# Altium project Hierarchical Project.PrjPcb
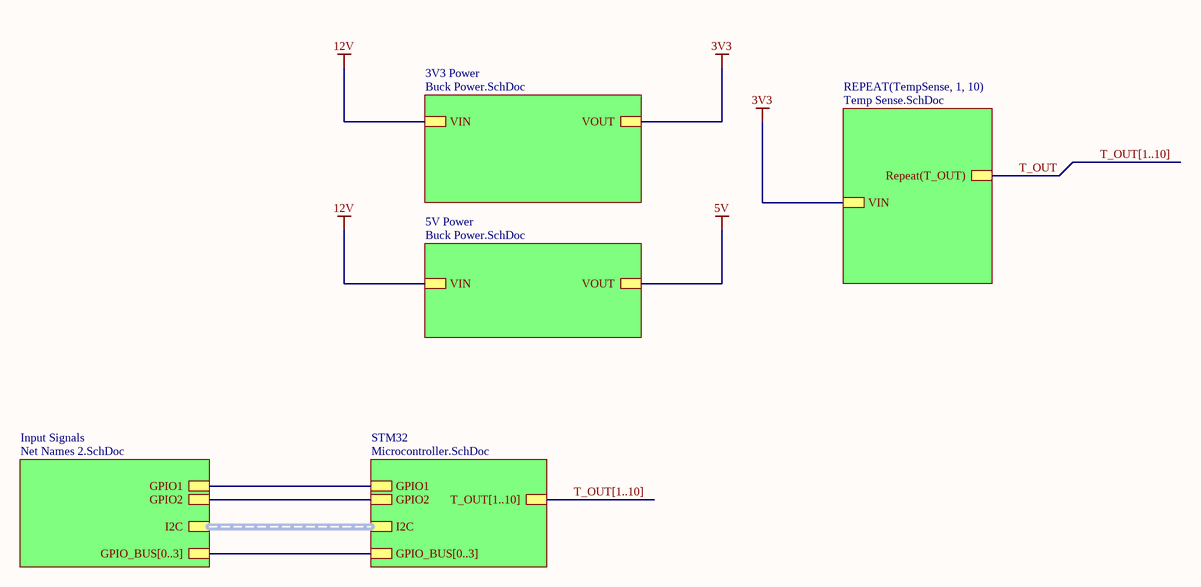
[diagram p0: Top.SchDoc]
5 sheets, 29 parts. Net scope: hierarchical (ports join the sheet entries above them; power ports are global).
Board file: Hierarchical Project.PcbDoc
Sheets:
  Top.SchDoc
    3V3 Power = Buck Power.SchDoc
    Input Signals = Net Names 2.SchDoc
    STM32 = Microcontroller.SchDoc
    5V Power = Buck Power.SchDoc
    TempSense1 = Temp Sense.SchDoc
    TempSense2 = Temp Sense.SchDoc
    TempSense3 = Temp Sense.SchDoc
    TempSense4 = Temp Sense.SchDoc
    TempSense5 = Temp Sense.SchDoc
    TempSense6 = Temp Sense.SchDoc
    TempSense7 = Temp Sense.SchDoc
    TempSense8 = Temp Sense.SchDoc
    TempSense9 = Temp Sense.SchDoc
    TempSense10 = Temp Sense.SchDoc

## Sheet Top.SchDoc
size A4; SheetNumber: 1; SheetTotal: 5

### Sub-sheets
3V3 Power = Buck Power.SchDoc: VIN, VOUT
5V Power = Buck Power.SchDoc: VIN, VOUT
Input Signals = Net Names 2.SchDoc: GPIO1, GPIO2, I2C (harness I2C), GPIO_BUS[0..3]
REPEAT(TempSense, 1, 10) = Temp Sense.SchDoc: VIN, Repeat(T_OUT)
STM32 = Microcontroller.SchDoc: GPIO1, GPIO2, I2C (harness I2C), GPIO_BUS[0..3], T_OUT[1..10]

### Nets
3V3: sheet 3V3 Power/VOUT, sheet REPEAT(TempSense, 1, 10)/VIN
12V: sheet 3V3 Power/VIN, sheet 5V Power/VIN
GPIO1: sheet Input Signals/GPIO1, sheet STM32/GPIO1
GPIO2: sheet Input Signals/GPIO2, sheet STM32/GPIO2
T_OUT: sheet REPEAT(TempSense, 1, 10)/Repeat(T_OUT)

### Buses and harness runs
bus sheet Input Signals/GPIO_BUS[0..3] = sheet STM32/GPIO_BUS[0..3]
bus T_OUT[1..10]
bus T_OUT[1..10] = sheet STM32/T_OUT[1..10]
harness sheet Input Signals/I2C = sheet STM32/I2C

## Sheet Buck Power.SchDoc
size A4; SheetNumber: 1; SheetTotal: 3
Used 2 times, as channels 3V3 Power, 5V Power. Parts and nets are listed once, with the designators drawn on the sheet.
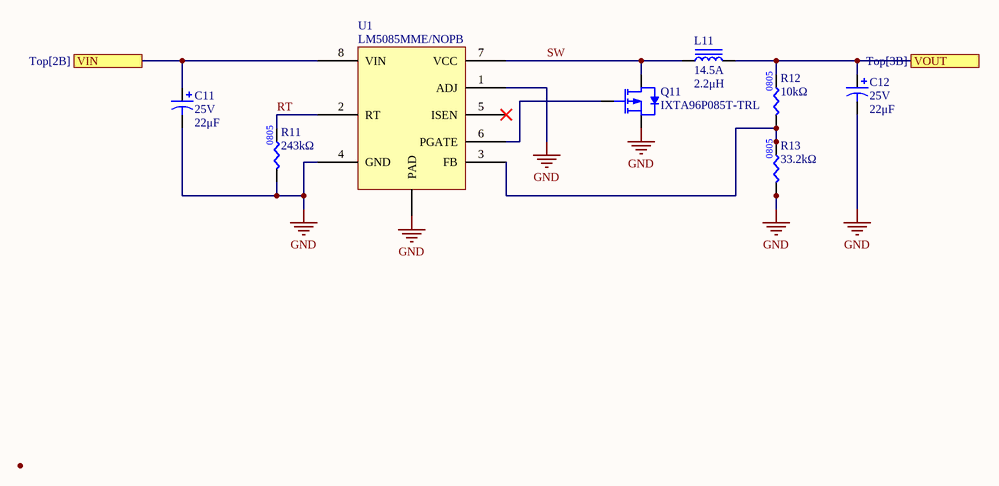
[diagram p1: Buck Power.SchDoc]

### Parts
C11  value 22μF  Voltage Rating: 25V  [CAP2917]  (hidden comment: CAP_22uF_25V_TANT)
C12  value 22μF  Voltage Rating: 25V  [CAP2917]  (hidden comment: CAP_22uF_25V_TANT)
L11  Current Rating: 14.5A  Inductance: 2.2μH  [IND_VISHAY_IHLP3232DZER2R2M11]  (hidden comment: IND_2.2uH_14.5A)
Q11  Manufacturer Part Number 1: IXTA96P085T-TRL  [D-PAK]  (hidden comment: PMOS_85V_96A)
R11  value 243kΩ  [RES0805]  (hidden comment: RES_243kΩ_0805_1%)
R12  value 10kΩ  [RES0805]  (hidden comment: RES_10kΩ_0805_5%)
R13  value 33.2kΩ  [RES0805]  (hidden comment: RES_33.2kΩ_0805_1%)
U1  Manufacturer Part Number 1: LM5085MME/NOPB  [8-VSSOP]  (hidden comment: BUCK_LMR14050SDDAR)

### Ports
VIN (see Top[2B]), VOUT (see Top[3B])

### Nets
GND: C11.2 C12.2 Q11.3(Source) R11.1 R13.1 U1.1(ADJ) U1.4(GND) U1.9(PAD)
RT: R11.2 U1.2(RT)
SW: L11.1 Q11.1(Drain) U1.7(VCC)
VIN: C11.1 U1.8(VIN) ; port VIN
VOUT: C12.1 L11.2 R12.2 ; port VOUT
NetQ11_2: Q11.2(Gate) U1.6(PGATE)
NetR12_1: R12.1 R13.2 U1.3(FB)

Not connected (* = marked no-connect by the designer): U1 5(ISEN)*

### Channels
3V3 Power: designators end in A; ports VIN=12V VOUT=3V3
5V Power: designators end in B; ports VIN=12V VOUT=5V

### Library data of the parts
C11 C12 = CAP_22uF_25V_TANT: CAP TANT 22UF 20% 25V 2917; Manufacturer Part Number 1: F971A106MBAHT3; Manufacturer 1: AVX Corporation; Supplier 1: Arrow Electronics; Supplier Part Number 1: TPSD226M025R0100
L11 = IND_2.2uH_14.5A: INDUCTOR 2.2UH 14.5A 9.41 MOHM; Manufacturer 1: Vishay Dale; Manufacturer Part Number 1: IHLP3232DZER2R2M11; Inductance Tolerance: 20%; Saturation Current: 10.2A; Supplier Part Number 1: 541-1350-1-ND; Supplier 1: Digi-Key; DC Resistance (DCR): 9.41mOhm; Mounting Type: SMD
Q11 = PMOS_85V_96A: MOSFET P-CH 85V 96A TO263; Manufacturer 1: IXYS; Package/Footprint: TO-263AA; Vgs (Max): ±15V; Mounting Type: SMD; Verified: No; Supplier 1: Digi-Key; Supplier Part Number 1: IXTA96P085T-TRLCT-ND; Id: 96A; Vdss: 85V
R11 = RES_243kΩ_0805_1%: RES 243K OHM 1% 1/8W 0805; Manufacturer 1: Stackpole Electronics Inc; Manufacturer Part Number 1: RMCF0805FT243K; Package/Footprint: 0805; Mounting Type: SMD; Supplier 1: Digi-Key; Supplier Part Number 1: RMCF0805FT243KCT-ND
R12 = RES_10kΩ_0805_5%: RES 10K OHM 5% 1/8W 0805; Manufacturer 1: Panasonic Electronic Components; Manufacturer Part Number 1: ERJ-6GEYJ103V; Package/Footprint: 0805; Supplier 1: Digi-Key; Supplier Part Number 1: P10KACT-ND; LCSC Part #: C17414; Mounting Type: SMD
R13 = RES_33.2kΩ_0805_1%: RES 33.2K OHM 1% 1/8W 0805; Manufacturer 1: Stackpole Electronics Inc; Manufacturer Part Number 1: RMCF0805FT33K2; Package/Footprint: 0805; Mounting Type: SMD; Supplier 1: Digi-Key; Supplier Part Number 1: RMCF0805FT33K2CT-ND
U1 = BUCK_LM5085: IC REG CTRLR BUCK 8VSSOP; Manufacturer 1: Texas Instruments; Output Type: Transistor Driver; Output Configuration: Positive; Package/Footprint: 8-VSSON; Mounting Type: SMD; Supplier 1: Digi-Key; Supplier Part Number 1: LM5085MME/NOPBCT-ND

## Sheet Net Names 2.SchDoc
size A4; SheetNumber: 4; SheetTotal: 4
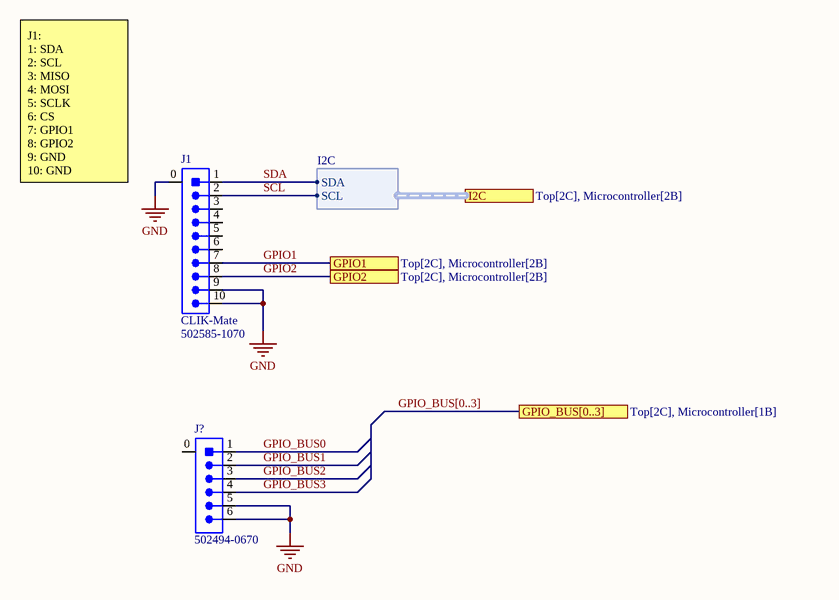
[diagram p2: Net Names 2.SchDoc]

### Parts
J1  Family: CLIK-Mate  Manufacturer Part Number 1: 502585-1070  [MOLEX-5025851070]  (hidden comment: CON_10M_SM_RA)
J?  Manufacturer Part Number 1: 502494-0670  [MOLEX-5024940670]  (hidden comment: CON_6M_SM_RA)

### Ports
GPIO1 (see Top[2C], Microcontroller[2B]), GPIO2 (see Top[2C], Microcontroller[2B]), GPIO_BUS[0..3] (see Top[2C], Microcontroller[1B]), I2C (harness I2C, see Top[2C], Microcontroller[2B])

### Harnesses
I2C: SDA, SCL

### Nets
GND: J1.0 J1.9 J1.10 J?.5 J?.6
GPIO1: J1.7 ; port GPIO1
GPIO2: J1.8 ; port GPIO2
GPIO_BUS0: J?.1
GPIO_BUS1: J?.2
GPIO_BUS2: J?.3
GPIO_BUS3: J?.4
SCL: J1.2 ; port I2C.SCL
SDA: J1.1 ; port I2C.SDA

Not connected (* = marked no-connect by the designer): J1 3 4 5 6; J? 0

### Buses and harness runs
bus GPIO_BUS[0..3] = port GPIO_BUS[0..3]

### Notes on the sheet
- J1:
  1: SDA
  2: SCL
  3: MISO
  4: MOSI
  5: SCLK
  6: CS
  7: GPIO1
  8: GPIO2
  9: GND
  10: GND

### Library data of the parts
J1 = CON_10M_SM_RA: CONN HEADER SMD RIGHT ANGLE 1.5 MM PITCH; Manufacturer 1: Molex; Current Rating: 2A; Voltage Rating: 100V; Pitch: 1.5mm; Supplier 1: Digi-Key; Supplier Part Number 1: WM14472CT-ND; Orientation: Right Angle
J? = CON_6M_SM_RA: CONN HEADER SMD RIGHT ANGLE 2MM PITCH; Manufacturer 1: Molex; Current Rating: 3A; Voltage Rating: 250V; Supplier 1: Digi-Key; Orientation: Right Angle; Pitch: 2mm; Supplier Part Number 1: WM2283CT-ND

## Sheet Microcontroller.SchDoc
size A4; SheetNumber: 3; SheetTotal: 5
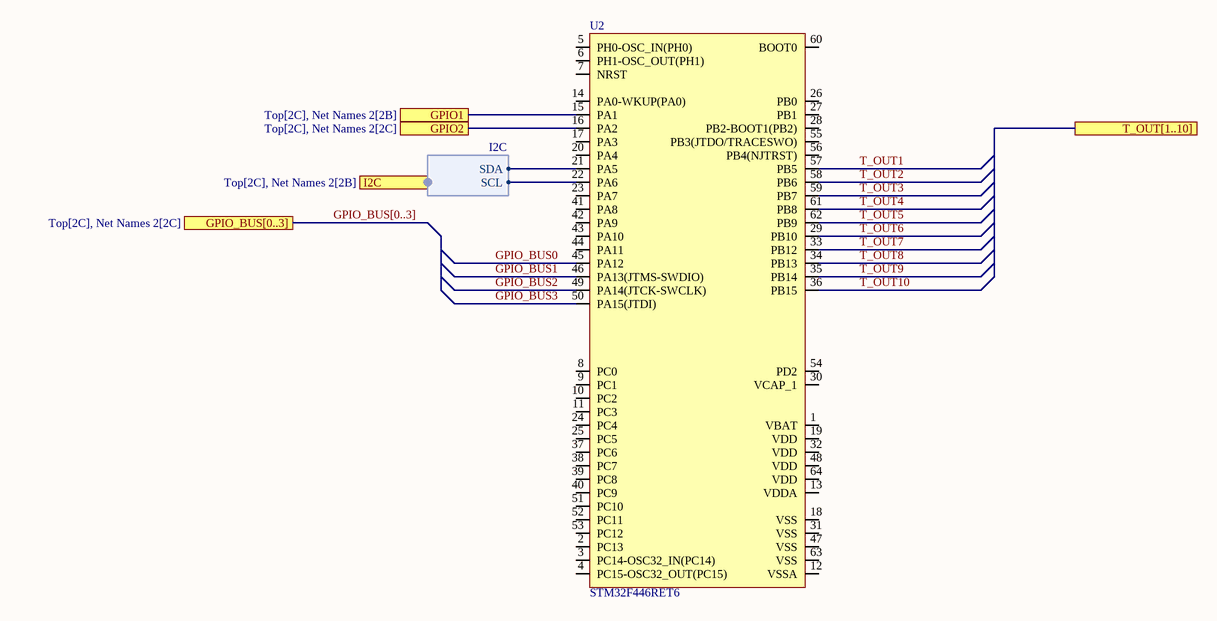
[diagram p3: Microcontroller.SchDoc]

### Parts
U2  STM32F446RET6  [STM_LQFP64_N]

### Ports
GPIO1 (see Top[2C], Net Names 2[2B]), GPIO2 (see Top[2C], Net Names 2[2C]), GPIO_BUS[0..3] (see Top[2C], Net Names 2[2C]), I2C (harness I2C, see Top[2C], Net Names 2[2B]), T_OUT[1..10]

### Harnesses
I2C: SDA, SCL

### Nets
GPIO1: U2.15(PA1) ; port GPIO1
GPIO2: U2.16(PA2) ; port GPIO2
GPIO_BUS0: U2.45(PA12)
GPIO_BUS1: U2.46(PA13(JTMS-SWDIO))
GPIO_BUS2: U2.49(PA14(JTCK-SWCLK))
GPIO_BUS3: U2.50(PA15(JTDI))
SCL: U2.22(PA6) ; port I2C.SCL
SDA: U2.21(PA5) ; port I2C.SDA
T_OUT1: U2.57(PB5)
T_OUT2: U2.58(PB6)
T_OUT3: U2.59(PB7)
T_OUT4: U2.61(PB8)
T_OUT5: U2.62(PB9)
T_OUT6: U2.29(PB10)
T_OUT7: U2.33(PB12)
T_OUT8: U2.34(PB13)
T_OUT9: U2.35(PB14)
T_OUT10: U2.36(PB15)

Not connected (* = marked no-connect by the designer): U2 1(VBAT) 2(PC13) 3(PC14-OSC32_IN(PC14)) 4(PC15-OSC32_OUT(PC15)) 5(PH0-OSC_IN(PH0)) 6(PH1-OSC_OUT(PH1)) 7(NRST) 8(PC0) 9(PC1) 10(PC2) 11(PC3) 12(VSSA) 13(VDDA) 14(PA0-WKUP(PA0)) 17(PA3) 18(VSS) 19(VDD) 20(PA4) 23(PA7) 24(PC4) 25(PC5) 26(PB0) 27(PB1) 28(PB2-BOOT1(PB2)) 30(VCAP_1) 31(VSS) 32(VDD) 37(PC6) 38(PC7) 39(PC8) 40(PC9) 41(PA8) 42(PA9) 43(PA10) 44(PA11) 47(VSS) 48(VDD) 51(PC10) 52(PC11) 53(PC12) 54(PD2) 55(PB3(JTDO/TRACESWO)) 56(PB4(NJTRST)) 60(BOOT0) 63(VSS) 64(VDD)

### Buses and harness runs
bus GPIO_BUS[0..3] = port GPIO_BUS[0..3]

### Library data of the parts
U2 = STM32F446RET6: IC MCU 32BIT 512KB FLASH 64LQFP; Manufacturer 1: STMicroelectronics; Manufacturer Part Number 1: LF80CDT-TR; Supplier 1: Digi-Key; Supplier Part Number 1: 497-15376-ND

## Sheet Temp Sense.SchDoc
size A4; SheetNumber: 5; SheetTotal: 5
Used 10 times, as channels TempSense1, TempSense2, TempSense3, TempSense4, TempSense5, TempSense6, TempSense7, TempSense8, TempSense9, TempSense10. Parts and nets are listed once, with the designators drawn on the sheet.
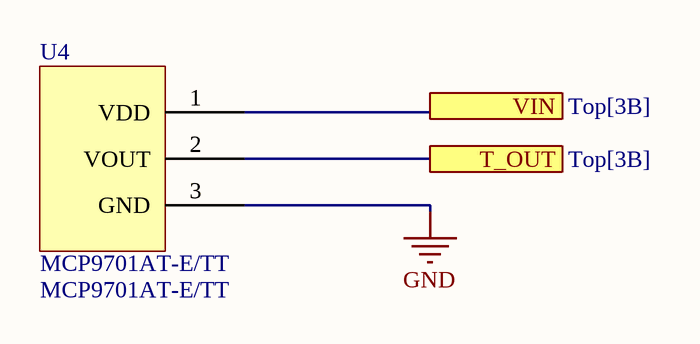
[diagram p4: Temp Sense.SchDoc]

### Parts
U4  MCP9701AT-E/TT  [MCP9701AT-E/TT]

### Ports
T_OUT (see Top[3B]), VIN (see Top[3B])

### Nets
GND: U4.3(GND)
T_OUT: U4.2(VOUT) ; port T_OUT
VIN: U4.1(VDD) ; port VIN

### Channels
TempSense1: designators end in A; ports T_OUT=T_OUT1 VIN=3V3
TempSense2: designators end in B; ports T_OUT=T_OUT2 VIN=3V3
TempSense3: designators end in C; ports T_OUT=T_OUT3 VIN=3V3
TempSense4: designators end in D; ports T_OUT=T_OUT4 VIN=3V3
TempSense5: designators end in E; ports T_OUT=T_OUT5 VIN=3V3
TempSense6: designators end in F; ports T_OUT=T_OUT6 VIN=3V3
TempSense7: designators end in G; ports T_OUT=T_OUT7 VIN=3V3
TempSense8: designators end in H; ports T_OUT=T_OUT8 VIN=3V3
TempSense9: designators end in I; ports T_OUT=T_OUT9 VIN=3V3
TempSense10: designators end in J; ports T_OUT=T_OUT10 VIN=3V3

### Library data of the parts
U4 = MCP9701AT-E/TT: IC THERMISTOR; Manufacturer 1: Microchip Technology; Supplier Part Number 1: MCP9701AT-E/TTTR-ND; Supplier 1: Digi-Key; Manufacturer Part Number 1: MCP9701AT-E/TT

## Nets that join several sheets
3V3: 3V3 Power (C12A.1 L11A.2 R12A.2), TempSense1 (U4A.1), TempSense2 (U4B.1), TempSense3 (U4C.1), TempSense4 (U4D.1), TempSense5 (U4E.1), TempSense6 (U4F.1), TempSense7 (U4G.1), TempSense8 (U4H.1), TempSense9 (U4I.1), TempSense10 (U4J.1)
12V: 3V3 Power (C11A.1 U1A.8), 5V Power (C11B.1 U1B.8)
GND: 3V3 Power (8 pins), Net Names 2 (5 pins), 5V Power (8 pins), TempSense1 (U4A.3), TempSense2 (U4B.3), TempSense3 (U4C.3), TempSense4 (U4D.3), TempSense5 (U4E.3), TempSense6 (U4F.3), TempSense7 (U4G.3), TempSense8 (U4H.3), TempSense9 (U4I.3), TempSense10 (U4J.3)
GPIO1: Net Names 2 (J1.7), Microcontroller (U2.15)
GPIO2: Net Names 2 (J1.8), Microcontroller (U2.16)
GPIO_BUS0: Net Names 2 (J?.1), Microcontroller (U2.45)
GPIO_BUS1: Net Names 2 (J?.2), Microcontroller (U2.46)
GPIO_BUS2: Net Names 2 (J?.3), Microcontroller (U2.49)
GPIO_BUS3: Net Names 2 (J?.4), Microcontroller (U2.50)
SCL: Net Names 2 (J1.2), Microcontroller (U2.22)
SDA: Net Names 2 (J1.1), Microcontroller (U2.21)

## Assembly variants
BUILD: alternate parts R13_5V Power -> RES_54.9kΩ_0805_1%